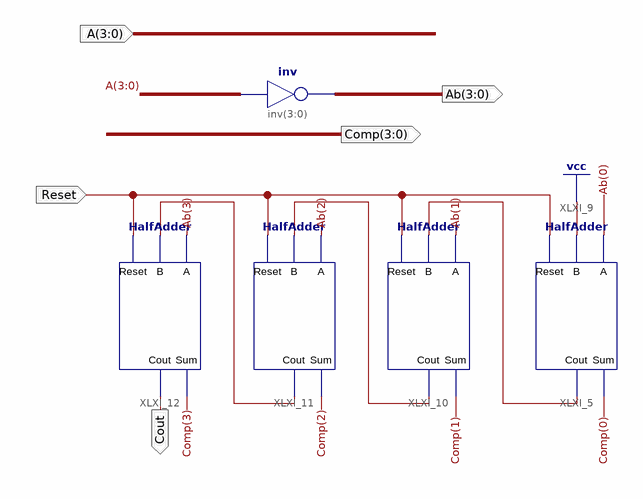
[diagram p0: schematic sheet 1]
// Xilinx ISE schematic FourBit2sComplement.sch (artix7) as structural Verilog: 5 symbols, 5 ports
module FourBit2sComplement (
  input  [3:0] A,
  input  Reset,
  output [3:0] Ab,
  output Cout,
  output [3:0] Comp
);

  wire XLXN_17, XLXN_21, XLXN_23;

  assign Ab = ~A;  // inv inv[3..0], 4 bits wide
  HalfAdder XLXI_5 (.A(Ab[0]), .B(1'b1), .Cout(XLXN_17), .Reset(Reset), .Sum(Comp[0]));
  HalfAdder XLXI_10 (.A(Ab[1]), .B(XLXN_17), .Cout(XLXN_21), .Reset(Reset), .Sum(Comp[1]));
  HalfAdder XLXI_11 (.A(Ab[2]), .B(XLXN_21), .Cout(XLXN_23), .Reset(Reset), .Sum(Comp[2]));
  HalfAdder XLXI_12 (.A(Ab[3]), .B(XLXN_23), .Cout(Cout), .Reset(Reset), .Sum(Comp[3]));
endmodule
